# Altium schematic sheet Sheet1.SchDoc: 51单片机计算器
size A4; Author: 樊厚翔; DrawnBy: 樊厚翔
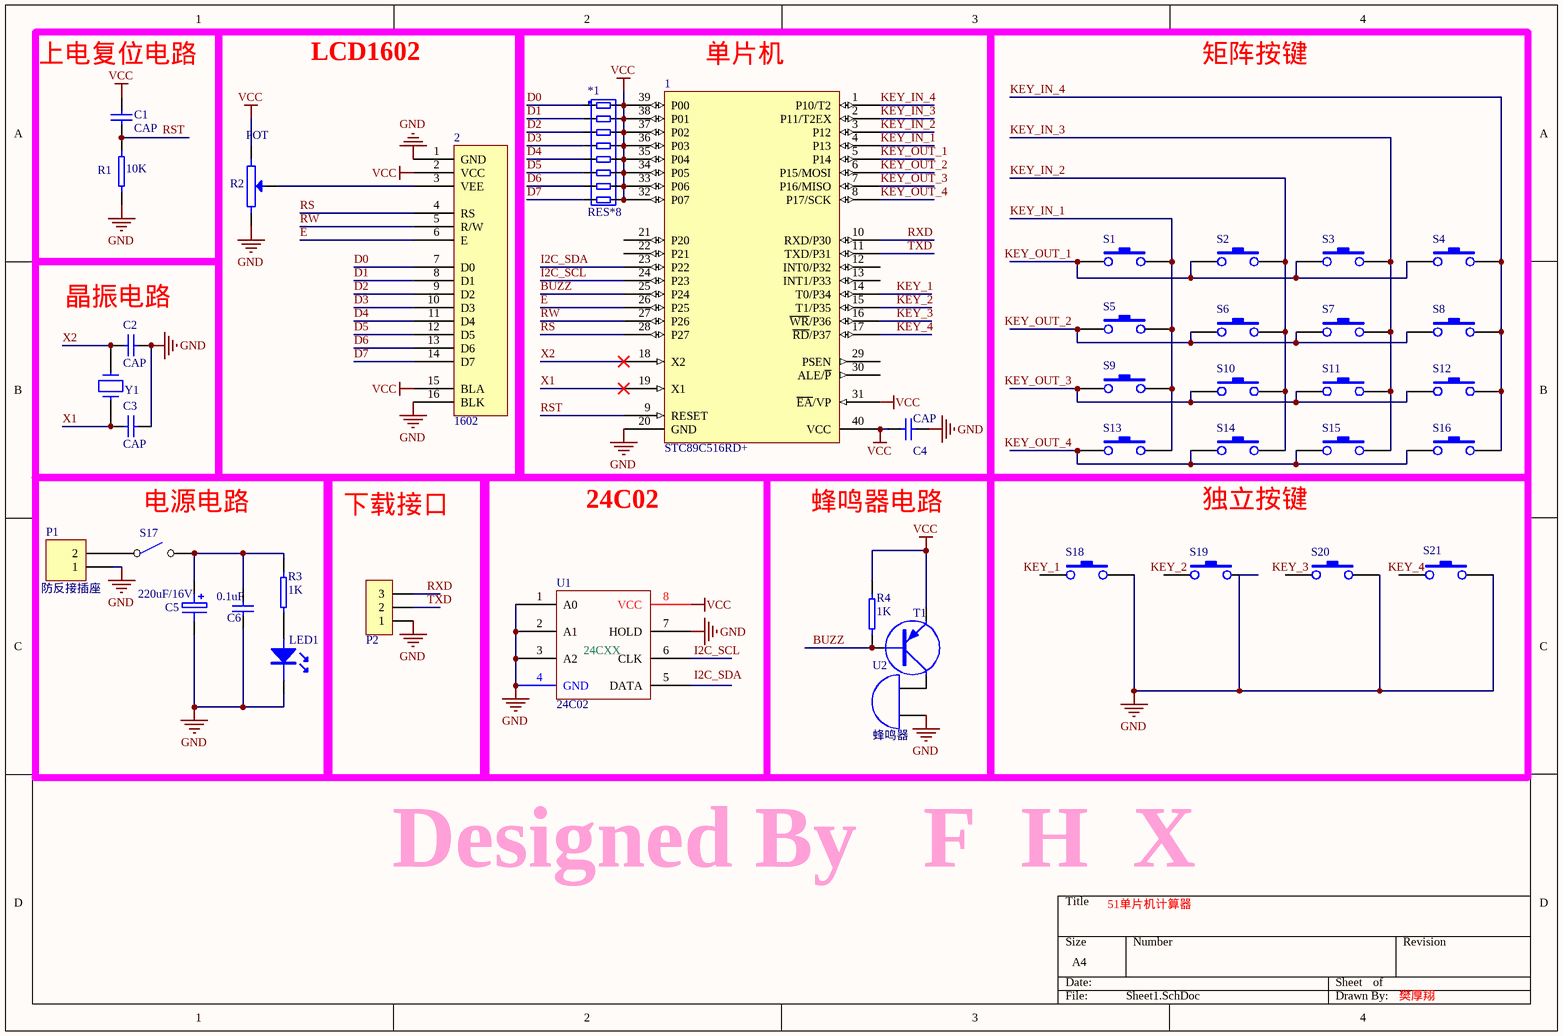
[diagram p0: Sheet1.SchDoc]

## Parts
1  STC89C516RD+  [DIP-40]
2  1602  [SIP16]
*1  RES*8  [SIP9]
C1  CAP  [10UF]
C2  CAP  [10UF]
C3  CAP  [10UF]
C4  CAP  [10UF]
C5  220uF/16V  [RB.2/.4]
C6  0.1uF  [10UF]
LED1  D-LED  [0805D]  (value not drawn)
P1  防反接插座  [HDR1X2]
P2  CON3  [SIP3]  (value not drawn)
R1  10K  [AXIAL0.4]
R2  POT  [RP3]
R3  1K  [AXIAL0.4]
R4  1K  [AXIAL0.4]
S1  微动开关  [SWITCH]  (value not drawn)
S2  微动开关  [SWITCH]  (value not drawn)
S3  微动开关  [SWITCH]  (value not drawn)
S4  微动开关  [SWITCH]  (value not drawn)
S5  微动开关  [SWITCH]  (value not drawn)
S6  微动开关  [SWITCH]  (value not drawn)
S7  微动开关  [SWITCH]  (value not drawn)
S8  微动开关  [SWITCH]  (value not drawn)
S9  微动开关  [SWITCH]  (value not drawn)
S10  微动开关  [SWITCH]  (value not drawn)
S11  微动开关  [SWITCH]  (value not drawn)
S12  微动开关  [SWITCH]  (value not drawn)
S13  微动开关  [SWITCH]  (value not drawn)
S14  微动开关  [SWITCH]  (value not drawn)
S15  微动开关  [SWITCH]  (value not drawn)
S16  微动开关  [SWITCH]  (value not drawn)
S17  SW-SPST  (value not drawn)
S18  微动开关  [SWITCH]  (value not drawn)
S19  微动开关  [SWITCH]  (value not drawn)
S20  微动开关  [SWITCH]  (value not drawn)
S21  微动开关  [SWITCH]  (value not drawn)
T1  PNP  [TO92C]  (value not drawn)
U1  24C02  [DIP8]
U2  蜂鸣器  [RB3/7MM]
Y1  CRY  [XTAL1]  (value not drawn)

## Blocks framed on the sheet
上电复位电路: C1 R1
LCD1602: 2 R2
单片机: 1 *1 C4
矩阵按键: S1-S16
晶振电路: C2 C3 Y1
电源电路: C5 C6 LED1 P1 R3 S17
下载接口: P2
24C02: U1
蜂鸣器电路: R4 T1 U2
独立按键: S18-S21

## Nets
GND: 1.20(GND) 2.1(GND) 2.16(BLK) C2.2 C3.2 C4.1 C5.2 C6.1 LED1.K P1.1 P2.1 R1.1 R2.3 S18.2 S19.2 S20.2 S21.2 U1.1(A0) U1.2(A1) U1.3(A2) U1.4(GND) U1.7(HOLD) U2.1(A)
VCC: 1.31(~{EA}/VP) 1.32(P07) 1.33(P06) 1.34(P05) 1.35(P04) 1.36(P03) 1.37(P02) 1.38(P01) 1.39(P00) 1.40(VCC) 2.2(VCC) 2.15(BLA) *1.9 *1.10 *1.11 *1.12 *1.13 *1.14 *1.15 *1.16 C1.2 C4.2 R2.1 R4.1 T1.3(E) U1.8(VCC)
BUZZ: 1.25(P24) R4.2 T1.1(B)
D0: 2.7(D0) *1.1
D1: 2.8(D1) *1.2
D2: 2.9(D2) *1.3
D3: 2.10(D3) *1.4
D4: 2.11(D4) *1.5
D5: 2.12(D5) *1.6
D6: 2.13(D6) *1.7
D7: 2.14(D7) *1.8
E: 1.26(P25) 2.6(E)
I2C_SCL: 1.24(P23) U1.6(CLK)
I2C_SDA: 1.23(P22)
KEY_1: 1.14(T0/P34)
KEY_2: 1.15(T1/P35)
KEY_3: 1.16(~{WR}/P36)
KEY_4: 1.17(~{RD}/P37)
KEY_IN_1: 1.4(P13) S1.2 S5.2 S9.2 S13.2
KEY_IN_2: 1.3(P12) S2.2 S6.2 S10.2 S14.2
KEY_IN_3: 1.2(P11/T2EX) S3.2 S7.2 S11.2 S15.2
KEY_IN_4: 1.1(P10/T2) S4.2 S8.2 S12.2 S16.2
KEY_OUT_1: 1.5(P14)
KEY_OUT_2: 1.6(P15/MOSI)
KEY_OUT_3: 1.7(P16/MISO)
KEY_OUT_4: 1.8(P17/SCK)
RS: 1.28(P27) 2.4(RS)
RST: 1.9(RESET) C1.1 R1.2
RW: 1.27(P26) 2.5(R/W)
RXD: 1.10(RXD/P30) P2.3
TXD: 1.11(TXD/P31) P2.2
X1: 1.19(X1) C3.1 Y1.2
X2: 1.18(X2) C2.1 Y1.1
Net2_3: 2.3(VEE) R2.2
NetC5_1: C5.1 C6.2 R3.1 S17.2
NetLED1_A: LED1.A R3.2
NetP1_2: P1.2 S17.1
NetS1_1: S1.1 S2.1 S3.1 S4.1
NetS5_1: S5.1 S6.1 S7.1 S8.1
NetS9_1: S9.1 S10.1 S11.1 S12.1
NetS13_1: S13.1 S14.1 S15.1 S16.1
NetT1_2: T1.2(C) U2.2(B)

Not connected (* = marked no-connect by the designer): 1 12(INT0/P32) 13(INT1/P33) 21(P20) 22(P21) 29(PSEN) 30(ALE/~{P}); S18 1; S19 1; S20 1; S21 1; U1 5(DATA)

## Notes on the sheet
- Designed By   F  H  X
- Labels drawn without touching a wire or pin: I2C_SDA, KEY_1, KEY_2, KEY_3, KEY_4, KEY_OUT_1, KEY_OUT_2, KEY_OUT_3, KEY_OUT_4

## Library data of the parts
1 = AT89S51
C5 = CAP-E: 电解电容
C6 = CAP
LED1 = D-LED: LED
P1 = Header 2: Header, 2-Pin; LatestRevisionDate: 17-Jul-2002; LatestRevisionNote: Re-released for DXP Platform.; Publisher: Altium Limited
R1 R3 R4 = RES
U1 = 24CXX
U2 = 蜂鸣器: Bell